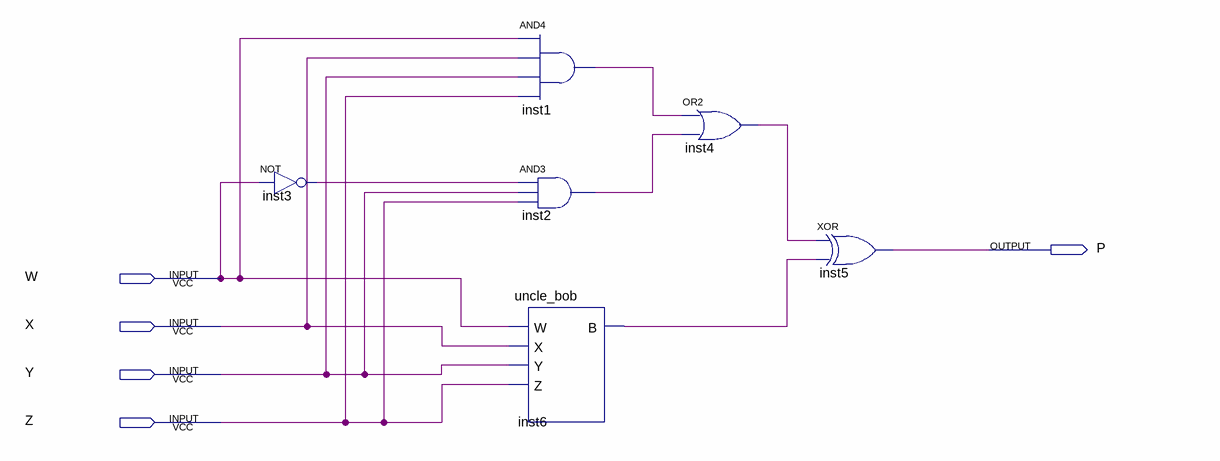
[diagram p0: schematic sheet]
// Quartus schematic uncle_bob_fix.bdf as structural Verilog: 6 symbols, 5 pins
module uncle_bob_fix (
  input  W,
  input  X,
  input  Y,
  input  Z,
  output P
);

  wire inst1_out, inst2_out, inst3_out, inst4_out, inst6_b;

  not inst3 (inst3_out, W);
  and inst1 (inst1_out, W, X, Y, Z);
  and inst2 (inst2_out, inst3_out, Y, Z);
  uncle_bob inst6 (.W(W), .X(X), .Y(Y), .Z(Z), .B(inst6_b));
  or inst4 (inst4_out, inst1_out, inst2_out);
  xor inst5 (P, inst4_out, inst6_b);
endmodule
